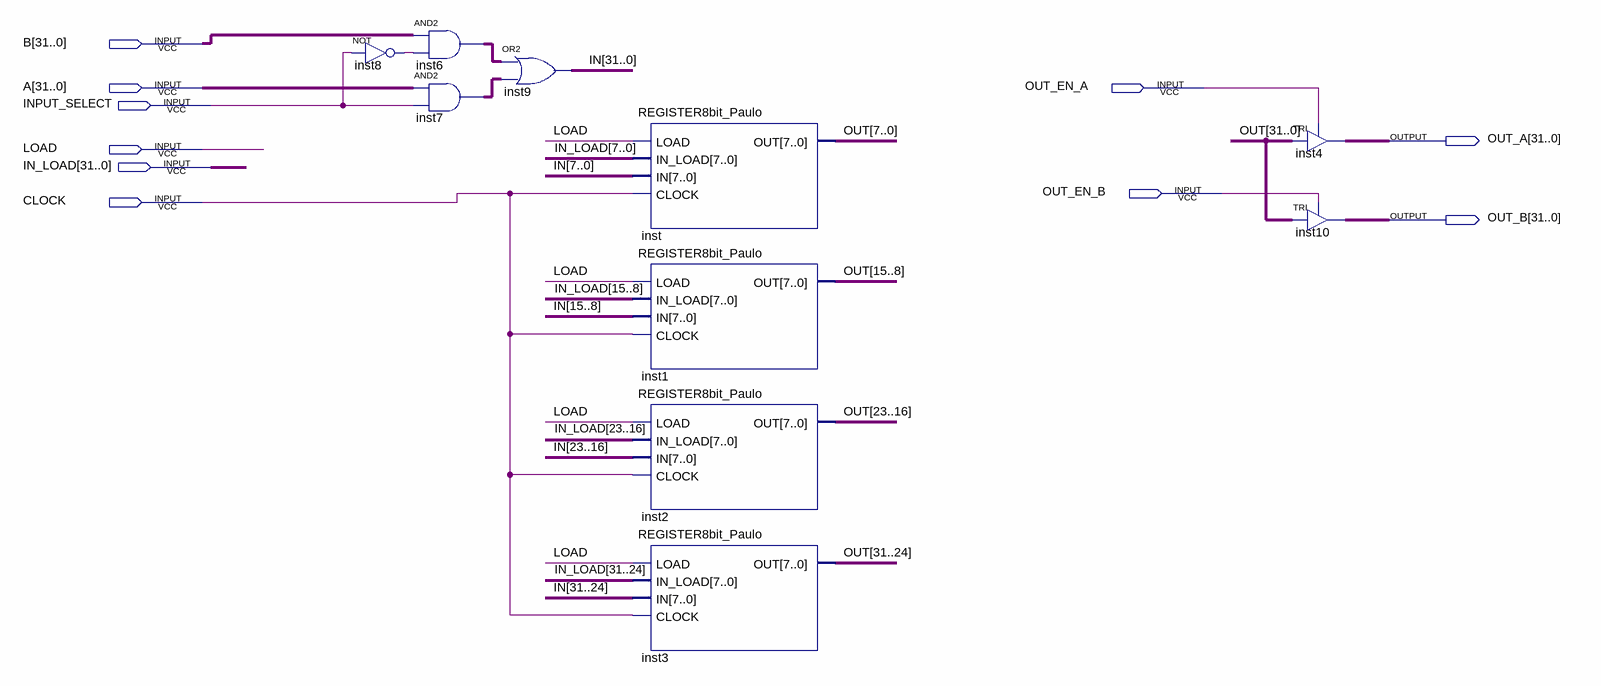
[diagram p0: schematic sheet]
// Quartus schematic REGISTER32bit_Paulo.bdf as structural Verilog: 10 symbols, 10 pins
module REGISTER32bit_Paulo (
  input  [31:0] B,
  input  [31:0] A,
  input  OUT_EN_A,
  input  INPUT_SELECT,
  input  LOAD,
  input  [31:0] IN_LOAD,
  input  OUT_EN_B,
  input  CLOCK,
  output [31:0] OUT_A,
  output [31:0] OUT_B
);

  wire inst8_out;
  wire [31:0] IN, inst6_out, inst7_out, OUT;

  not inst8 (inst8_out, INPUT_SELECT);
  assign inst6_out = B & {32{inst8_out}};  // AND2 inst6, 32 bits wide
  assign inst7_out = A & {32{INPUT_SELECT}};  // AND2 inst7, 32 bits wide
  assign IN = inst6_out | inst7_out;  // OR2 inst9, 32 bits wide
  REGISTER8bit_Paulo inst (.LOAD(LOAD), .IN_LOAD(IN_LOAD[7:0]), .IN(IN[7:0]), .CLOCK(CLOCK), .OUT(OUT[7:0]));
  REGISTER8bit_Paulo inst1 (.LOAD(LOAD), .IN_LOAD(IN_LOAD[15:8]), .IN(IN[15:8]), .CLOCK(CLOCK), .OUT(OUT[15:8]));
  REGISTER8bit_Paulo inst2 (.LOAD(LOAD), .IN_LOAD(IN_LOAD[23:16]), .IN(IN[23:16]), .CLOCK(CLOCK), .OUT(OUT[23:16]));
  REGISTER8bit_Paulo inst3 (.LOAD(LOAD), .IN_LOAD(IN_LOAD[31:24]), .IN(IN[31:24]), .CLOCK(CLOCK), .OUT(OUT[31:24]));
  TRI inst4[31:0] (.IN(OUT), .OE(OUT_EN_A), .OUT(OUT_A));
  TRI inst10[31:0] (.IN(OUT), .OE(OUT_EN_B), .OUT(OUT_B));
endmodule
